# EAGLE design sram_v3 (EAGLE 6.5.0)
SRAM
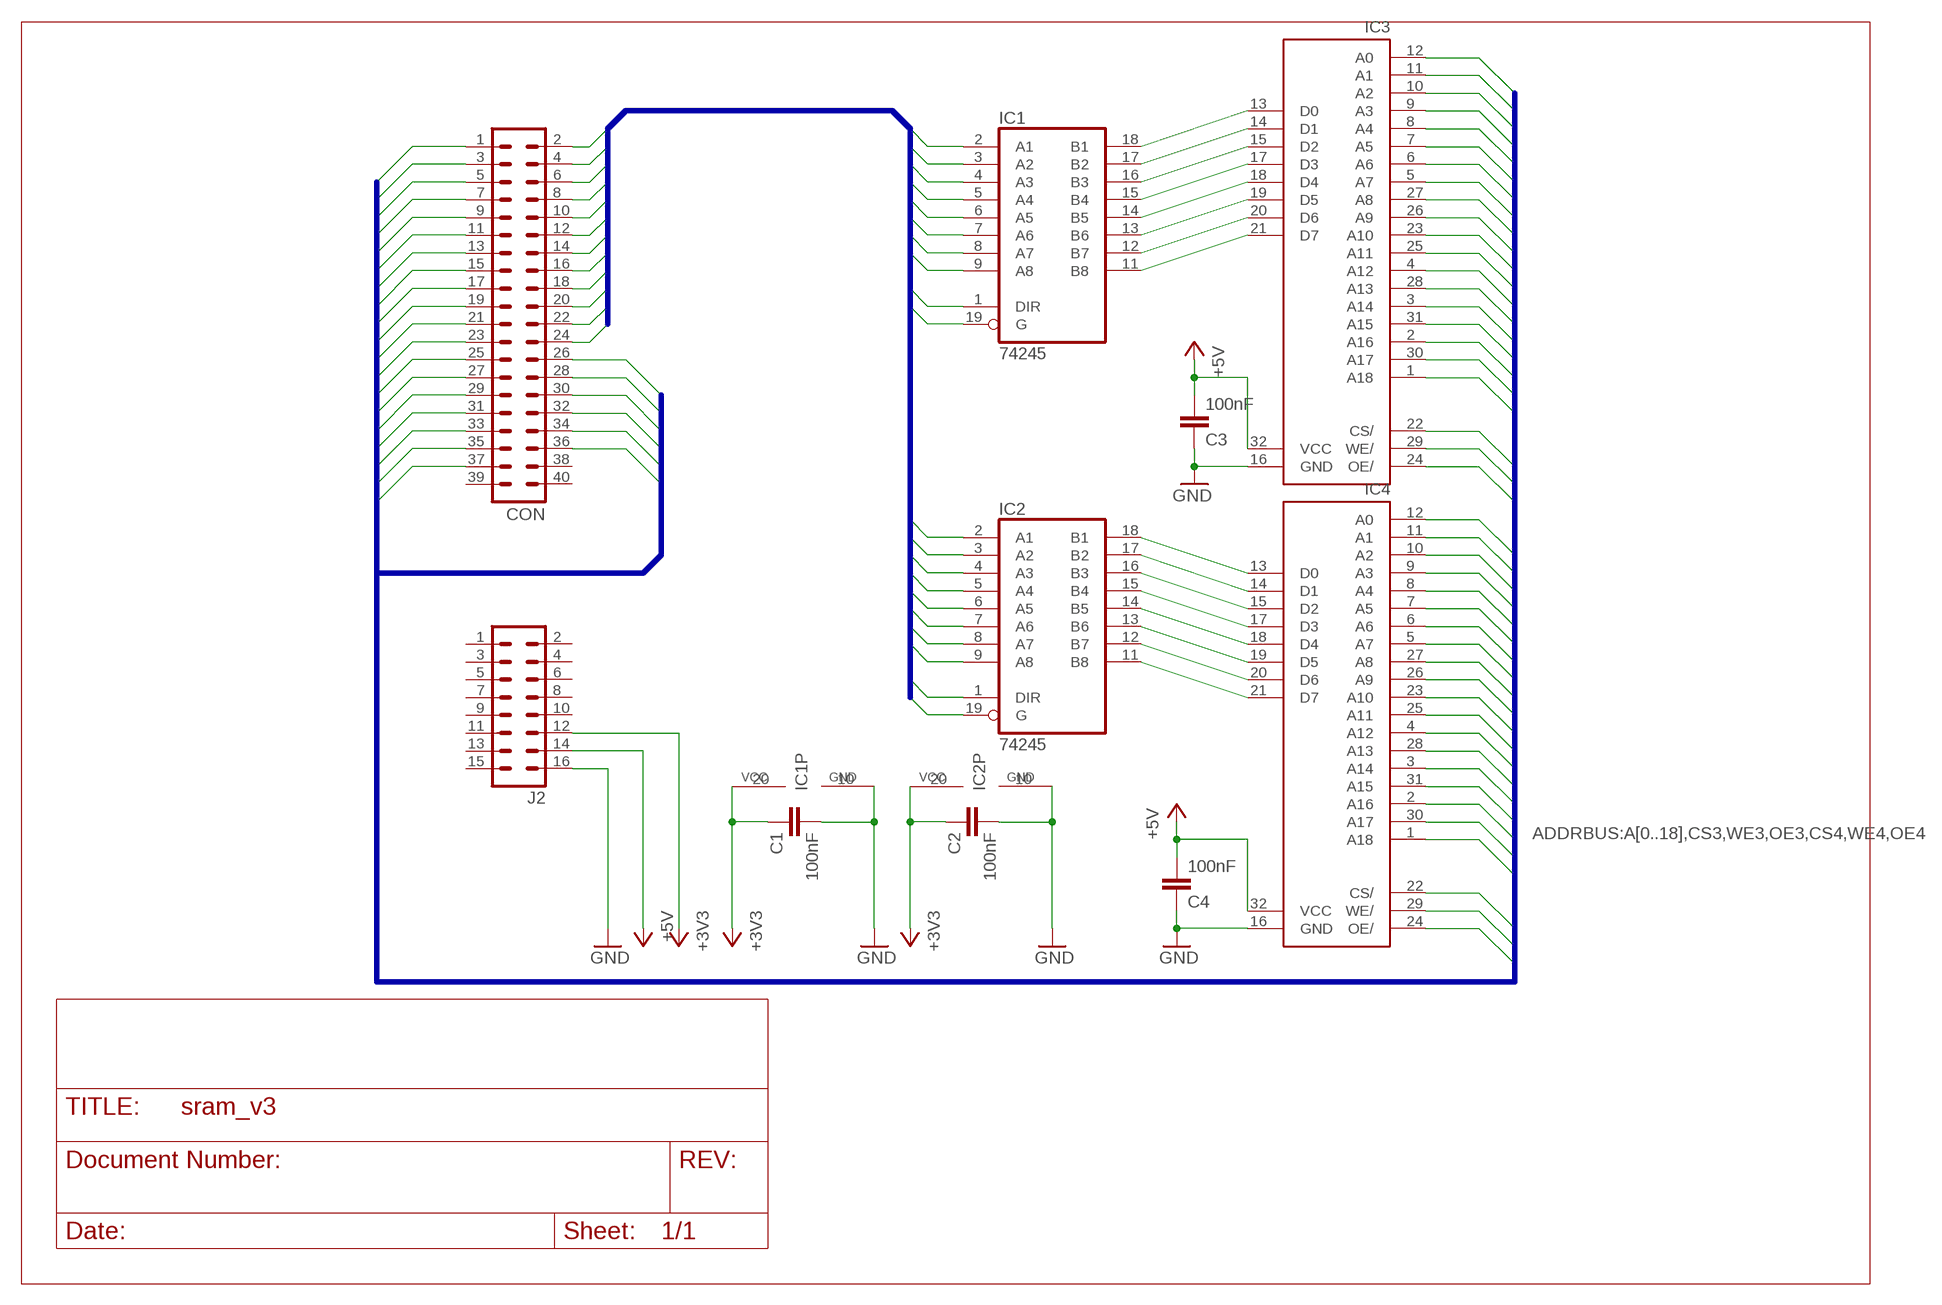
[diagram p0: schematic, sheet 1]

## Parts
C1  100nF  C-EU050-030X075  [C050-030X075]
C2  100nF  C-EU050-030X075  [C050-030X075]
C3  100nF  C-EU050-030X075  [C050-030X075]
C4  100nF  C-EU050-030X075  [C050-030X075]
CON  ML40  [ML40]
IC1  74245  [TSSOP20]
IC2  74245  [TSSOP20]
IC3  MEMORY-SAMSUNG-2_KM628512-XX  [MEMORY-SAMSUNG-2_SOP-32]
IC4  MEMORY-SAMSUNG-2_KM628512-XX  [MEMORY-SAMSUNG-2_SOP-32]
J2  ML16  [ML16]

## Nets
+3V3: C1.1 C2.1 IC1.20(VCC) IC2.20(VCC) J2.12
+5V: C3.2 C4.2 IC3.32(VCC) IC4.32(VCC) J2.14
A0: CON.37 IC3.12(A0) IC4.12(A0)
A1: CON.35 IC3.11(A1) IC4.11(A1)
A2: CON.33 IC3.10(A2) IC4.10(A2)
A3: CON.31 IC3.9(A3) IC4.9(A3)
A4: CON.29 IC3.8(A4) IC4.8(A4)
A5: CON.27 IC3.7(A5) IC4.7(A5)
A6: CON.25 IC3.6(A6) IC4.6(A6)
A7: CON.23 IC3.5(A7) IC4.5(A7)
A8: CON.21 IC3.27(A8) IC4.27(A8)
A9: CON.19 IC3.26(A9) IC4.26(A9)
A10: CON.17 IC3.23(A10) IC4.23(A10)
A11: CON.15 IC3.25(A11) IC4.25(A11)
A12: CON.13 IC3.4(A12) IC4.4(A12)
A13: CON.11 IC3.28(A13) IC4.28(A13)
A14: CON.9 IC3.3(A14) IC4.3(A14)
A15: CON.7 IC3.31(A15) IC4.31(A15)
A16: CON.5 IC3.2(A16) IC4.2(A16)
A17: CON.3 IC3.30(A17) IC4.30(A17)
A18: CON.1 IC3.1(A18) IC4.1(A18)
CS3: CON.26 IC3.22(CS/)
CS4: CON.32 IC4.22(CS/)
D0: CON.16 IC1.2(A1) IC2.2(A1)
D1: CON.14 IC1.3(A2) IC2.3(A2)
D2: CON.12 IC1.4(A3) IC2.4(A3)
D3: CON.10 IC1.5(A4) IC2.5(A4)
D4: CON.8 IC1.6(A5) IC2.6(A5)
D5: CON.6 IC1.7(A6) IC2.7(A6)
D6: CON.4 IC1.8(A7) IC2.8(A7)
D7: CON.2 IC1.9(A8) IC2.9(A8)
DIR1: CON.18 IC1.1(DIR)
DIR2: CON.22 IC2.1(DIR)
G1: CON.20 IC1.19(G)
G2: CON.24 IC2.19(G)
GND: C1.2 C2.2 C3.1 C4.1 IC1.10(GND) IC2.10(GND) IC3.16(GND) IC4.16(GND) J2.16
N$1: IC1.18(B1) IC3.13(D0)
N$2: IC1.17(B2) IC3.14(D1)
N$3: IC1.16(B3) IC3.15(D2)
N$4: IC1.15(B4) IC3.17(D3)
N$5: IC1.14(B5) IC3.18(D4)
N$6: IC1.13(B6) IC3.19(D5)
N$7: IC1.12(B7) IC3.20(D6)
N$8: IC1.11(B8) IC3.21(D7)
N$9: IC2.18(B1) IC4.13(D0)
N$10: IC2.17(B2) IC4.14(D1)
N$11: IC2.16(B3) IC4.15(D2)
N$12: IC2.15(B4) IC4.17(D3)
N$13: IC2.14(B5) IC4.18(D4)
N$14: IC2.13(B6) IC4.19(D5)
N$15: IC2.12(B7) IC4.20(D6)
N$16: IC2.11(B8) IC4.21(D7)
OE3: CON.30 IC3.24(OE/)
OE4: CON.36 IC4.24(OE/)
WE3: CON.28 IC3.29(WE/)
WE4: CON.34 IC4.29(WE/)
Unconnected: CON.38 CON.39 CON.40 J2.1 J2.2 J2.3 J2.4 J2.5 J2.6 J2.7 J2.8 J2.9 J2.10 J2.11 J2.13 J2.15

## Buses
ADDRBUS:A[0..18],CS3,WE3,OE3,CS4,WE4,OE4
DATABUS:D[0..7],DIR1,G1,DIR2,G2

## Library data of the parts
C1-C4 = rcl:C-EU: CAPACITOR, European symbol
CON = con-harting-ml:ML40: HARTING; OC_FARNELL: unknown; OC_NEWARK: unknown
IC1 IC2 = adafruit:74*245: Octal BUS TRANSCEIVER, 3-state
IC3 IC4 = snesram:MEMORY-SAMSUNG-2_KM628512-XX
J2 = con-harting-ml:ML16: HARTING; OC_FARNELL: unknown; OC_NEWARK: unknown

## Board
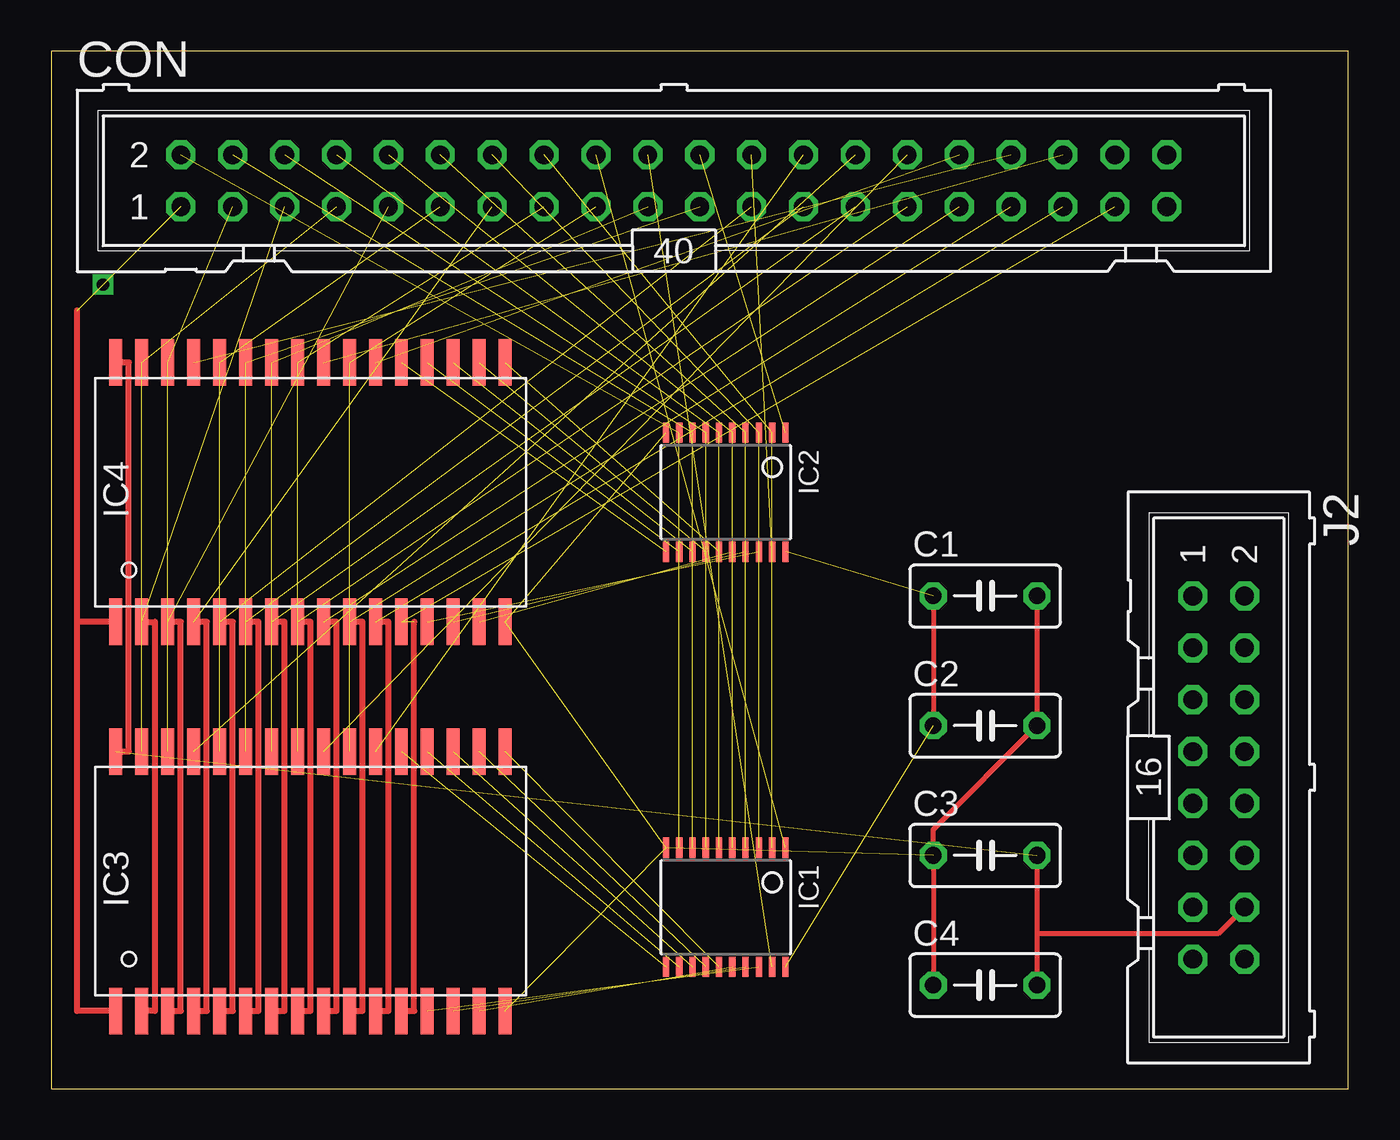
[diagram p1: board, top side]
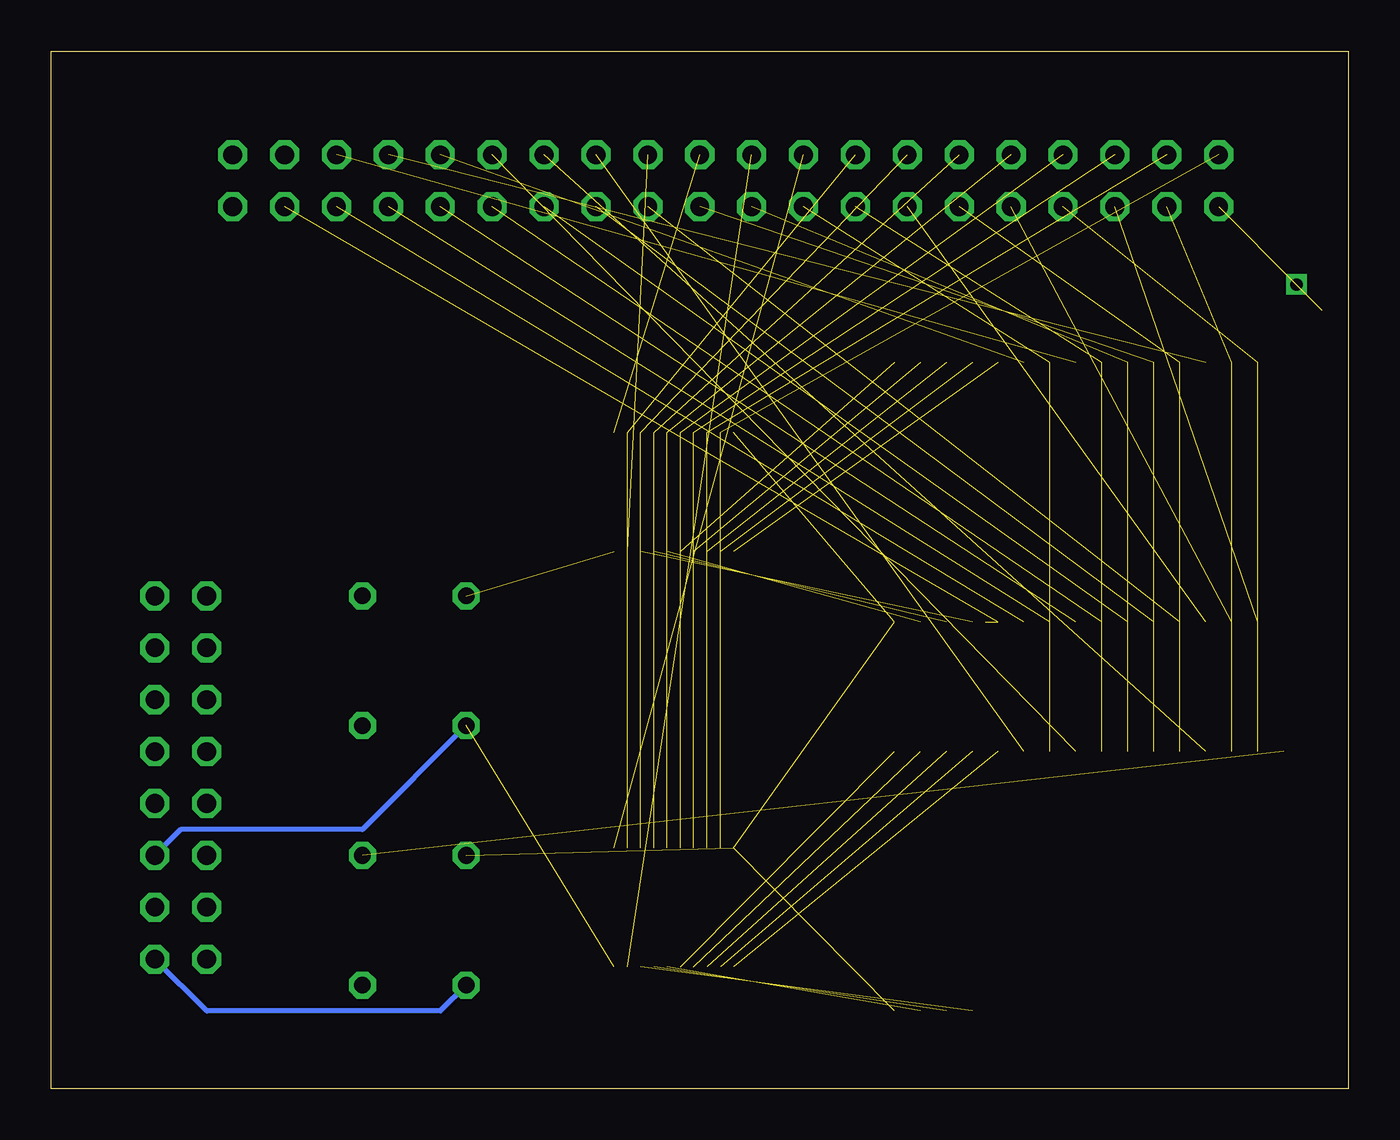
[diagram p2: board, bottom side, seen from below]

Size 63.5 x 50.8 mm. Coordinates in mm from the lower left corner, seen from the top.
Outline: 0,0 63.5,0 63.5,50.8 0,50.8 0,0
Copper layers (1*16): Top 0.035mm / dielectric 1.5mm / Bottom 0.035mm
Design rules "default": minimum track width 10mil, minimum drill 24mil, track to track 8mil, track to pad 8mil, pad to pad 8mil, via to via 8mil, smd to smd 8mil, copper to edge 40mil, drill to drill 8mil, minimum pad ring 10mil, minimum via ring 8mil, stop-mask expansion 4mil, vias tented up to drill 0mil, thermal gap 10mil

### Footprints (pad centres in the part's own frame; a part is rotated, then mirrored left to right if it is on the bottom)
C050-030X075 = drill 0.813 octagon: 1 -2.54,0; 2 2.54,0
ML40 = drill 0.914 octagon: 1 -24.13,-1.27; 2 -24.13,1.27; 3 -21.59,-1.27; 4 -21.59,1.27; 5 -19.05,-1.27; 6 -19.05,1.27; 7 -16.51,-1.27; 8 -16.51,1.27; 9 -13.97,-1.27; 10 -13.97,1.27; 11 -11.43,-1.27; 12 -11.43,1.27; 13 -8.89,-1.27; 14 -8.89,1.27; 15 -6.35,-1.27; 16 -6.35,1.27; 17 -3.81,-1.27; 18 -3.81,1.27; 19 -1.27,-1.27; 20 -1.27,1.27; 21 1.27,-1.27; 22 1.27,1.27; 23 3.81,-1.27; 24 3.81,1.27; 25 6.35,-1.27; 26 6.35,1.27; 27 8.89,-1.27; 28 8.89,1.27; 29 11.43,-1.27; 30 11.43,1.27; 31 13.97,-1.27; 32 13.97,1.27; 33 16.51,-1.27; 34 16.51,1.27; 35 19.05,-1.27; 36 19.05,1.27; 37 21.59,-1.27; 38 21.59,1.27; 39 24.13,-1.27; 40 24.13,1.27
TSSOP20 = smd 0.305 x 0.991: 1 -2.925,-2.918; 2 -2.275,-2.918; 3 -1.625,-2.918; 4 -0.975,-2.918; 5 -0.325,-2.918; 6 0.325,-2.918; 7 0.975,-2.918; 8 1.625,-2.918; 9 2.275,-2.918; 10 2.925,-2.918; 11 2.925,2.918; 12 2.275,2.918; 13 1.625,2.918; 14 0.975,2.918; 15 0.325,2.918; 16 -0.325,2.918; 17 -0.975,2.918; 18 -1.625,2.918; 19 -2.275,2.918; 20 -2.925,2.918
MEMORY-SAMSUNG-2_SOP-32 = smd 0.635 x 2.286: 1 -9.525,-6.35; 2 -8.255,-6.35; 3 -6.985,-6.35; 4 -5.715,-6.35; 5 -4.445,-6.35; 6 -3.175,-6.35; 7 -1.905,-6.35; 8 -0.635,-6.35; 9 0.635,-6.35; 10 1.905,-6.35; 11 3.175,-6.35; 12 4.445,-6.35; 13 5.715,-6.35; 14 6.985,-6.35; 15 8.255,-6.35; 16 9.525,-6.35; 17 9.525,6.35; 18 8.255,6.35; 19 6.985,6.35; 20 5.715,6.35; 21 4.445,6.35; 22 3.175,6.35; 23 1.905,6.35; 24 0.635,6.35; 25 -0.635,6.35; 26 -1.905,6.35; 27 -3.175,6.35; 28 -4.445,6.35; 29 -5.715,6.35; 30 -6.985,6.35; 31 -8.255,6.35; 32 -9.525,6.35
ML16 = drill 0.914 octagon: 1 -8.89,-1.27; 2 -8.89,1.27; 3 -6.35,-1.27; 4 -6.35,1.27; 5 -3.81,-1.27; 6 -3.81,1.27; 7 -1.27,-1.27; 8 -1.27,1.27; 9 1.27,-1.27; 10 1.27,1.27; 11 3.81,-1.27; 12 3.81,1.27; 13 6.35,-1.27; 14 6.35,1.27; 15 8.89,-1.27; 16 8.89,1.27

### Placement (x,y rotation side)
C1  45.72,24.13 0 top
C2  45.72,17.78 0 top
C3  45.72,11.43 0 top
C4  45.72,5.08 0 top
CON  30.48,44.45 0 top
IC1  33.02,8.89 180 top
IC2  33.02,29.21 180 top
IC3  12.7,10.16 0 top
IC4  12.7,29.21 0 top
J2  57.15,15.24 270 top

### Tracks (layer width: path | path; a pad name or v marks a point on that pad's centre or on a via)
+3V3  (2 unrouted)
  Top 0.254: C1.1 C2.1
  Bottom 0.254: J2.12 57.15,12.7 48.26,12.7 C2.1
+5V  (1 unrouted)
  Top 0.254: C3.2 48.26,7.62 | 48.26,7.62 C4.2 | J2.14 57.15,7.62 48.26,7.62
  Top 0.305: IC3.32 3.81,16.51 3.81,35.56 IC4.32
A0  (2 unrouted)
  Top 0.305: IC3.12 17.78,3.81 17.78,22.86
A1  (1 unrouted)
  Top 0.305: IC3.11 16.51,3.81 16.51,22.86 IC4.11
A2  (1 unrouted)
  Top 0.305: IC3.10 15.24,3.81 15.24,22.86 IC4.10
A3  (1 unrouted)
  Top 0.305: IC3.9 13.97,3.81 13.97,22.86 IC4.9
A4  (1 unrouted)
  Top 0.305: IC3.8 12.7,3.81 12.7,22.86 IC4.8
A5  (1 unrouted)
  Top 0.305: IC3.7 11.43,3.81 11.43,22.86 IC4.7
A6  (1 unrouted)
  Top 0.305: IC3.6 10.16,3.81 10.16,22.86 IC4.6
A7  (1 unrouted)
  Top 0.305: IC3.5 8.89,3.81 8.89,22.86 IC4.5
A8  (2 unrouted)
A9  (2 unrouted)
A10  (2 unrouted)
A11  (2 unrouted)
A12  (1 unrouted)
  Top 0.305: IC3.4 7.62,3.81 7.62,22.86 IC4.4
A13  (2 unrouted)
A14  (1 unrouted)
  Top 0.305: IC3.3 6.35,3.81 6.35,22.86 IC4.3
A15  (2 unrouted)
A16  (1 unrouted)
  Top 0.305: IC4.2 5.08,22.86 5.08,3.81 IC3.2
A17  (2 unrouted)
A18  (via drill 0.6)  (2 unrouted)
  Top 0.305: IC3.1 1.27,3.81 1.27,22.86 | IC4.1 1.27,22.86 | 1.27,22.86 1.27,38.1
  other vias: 2.54,39.37
CS3  (1 unrouted)
CS4  (1 unrouted)
D0  (2 unrouted)
D1  (2 unrouted)
D2  (2 unrouted)
D3  (2 unrouted)
D4  (2 unrouted)
D5  (2 unrouted)
D6  (2 unrouted)
D7  (2 unrouted)
DIR1  (1 unrouted)
DIR2  (1 unrouted)
G1  (1 unrouted)
G2  (1 unrouted)
GND  (4 unrouted)
  Top 0.254: C1.2 C2.2 43.18,12.7 C3.1 C4.1
  Bottom 0.254: J2.16 55.88,3.81 44.45,3.81 C4.1
N$1  (1 unrouted)
N$2  (1 unrouted)
N$3  (1 unrouted)
N$4  (1 unrouted)
N$5  (1 unrouted)
N$6  (1 unrouted)
N$7  (1 unrouted)
N$8  (1 unrouted)
N$9  (1 unrouted)
N$10  (1 unrouted)
N$11  (1 unrouted)
N$12  (1 unrouted)
N$13  (1 unrouted)
N$14  (1 unrouted)
N$15  (1 unrouted)
N$16  (1 unrouted)
OE3  (1 unrouted)
OE4  (1 unrouted)
WE3  (1 unrouted)
WE4  (1 unrouted)